# EasyEDA Pro project pcb easy eda pro stm32wb5mmg01 - Elektor.eprj, schematic Power command for stm32wb5
Create Date: 2024-01-22; Page Name: P1; Project Name: stm32wb5mmg01; Schematic Name: Schematic1; Update Date: 2024-01-22; Company: EasyEDA.com; Drawn: EasyEDA; Page Size: A4; Part Number: JLCPCB-002; Reviewed: EasyEDA; Version: V0.1
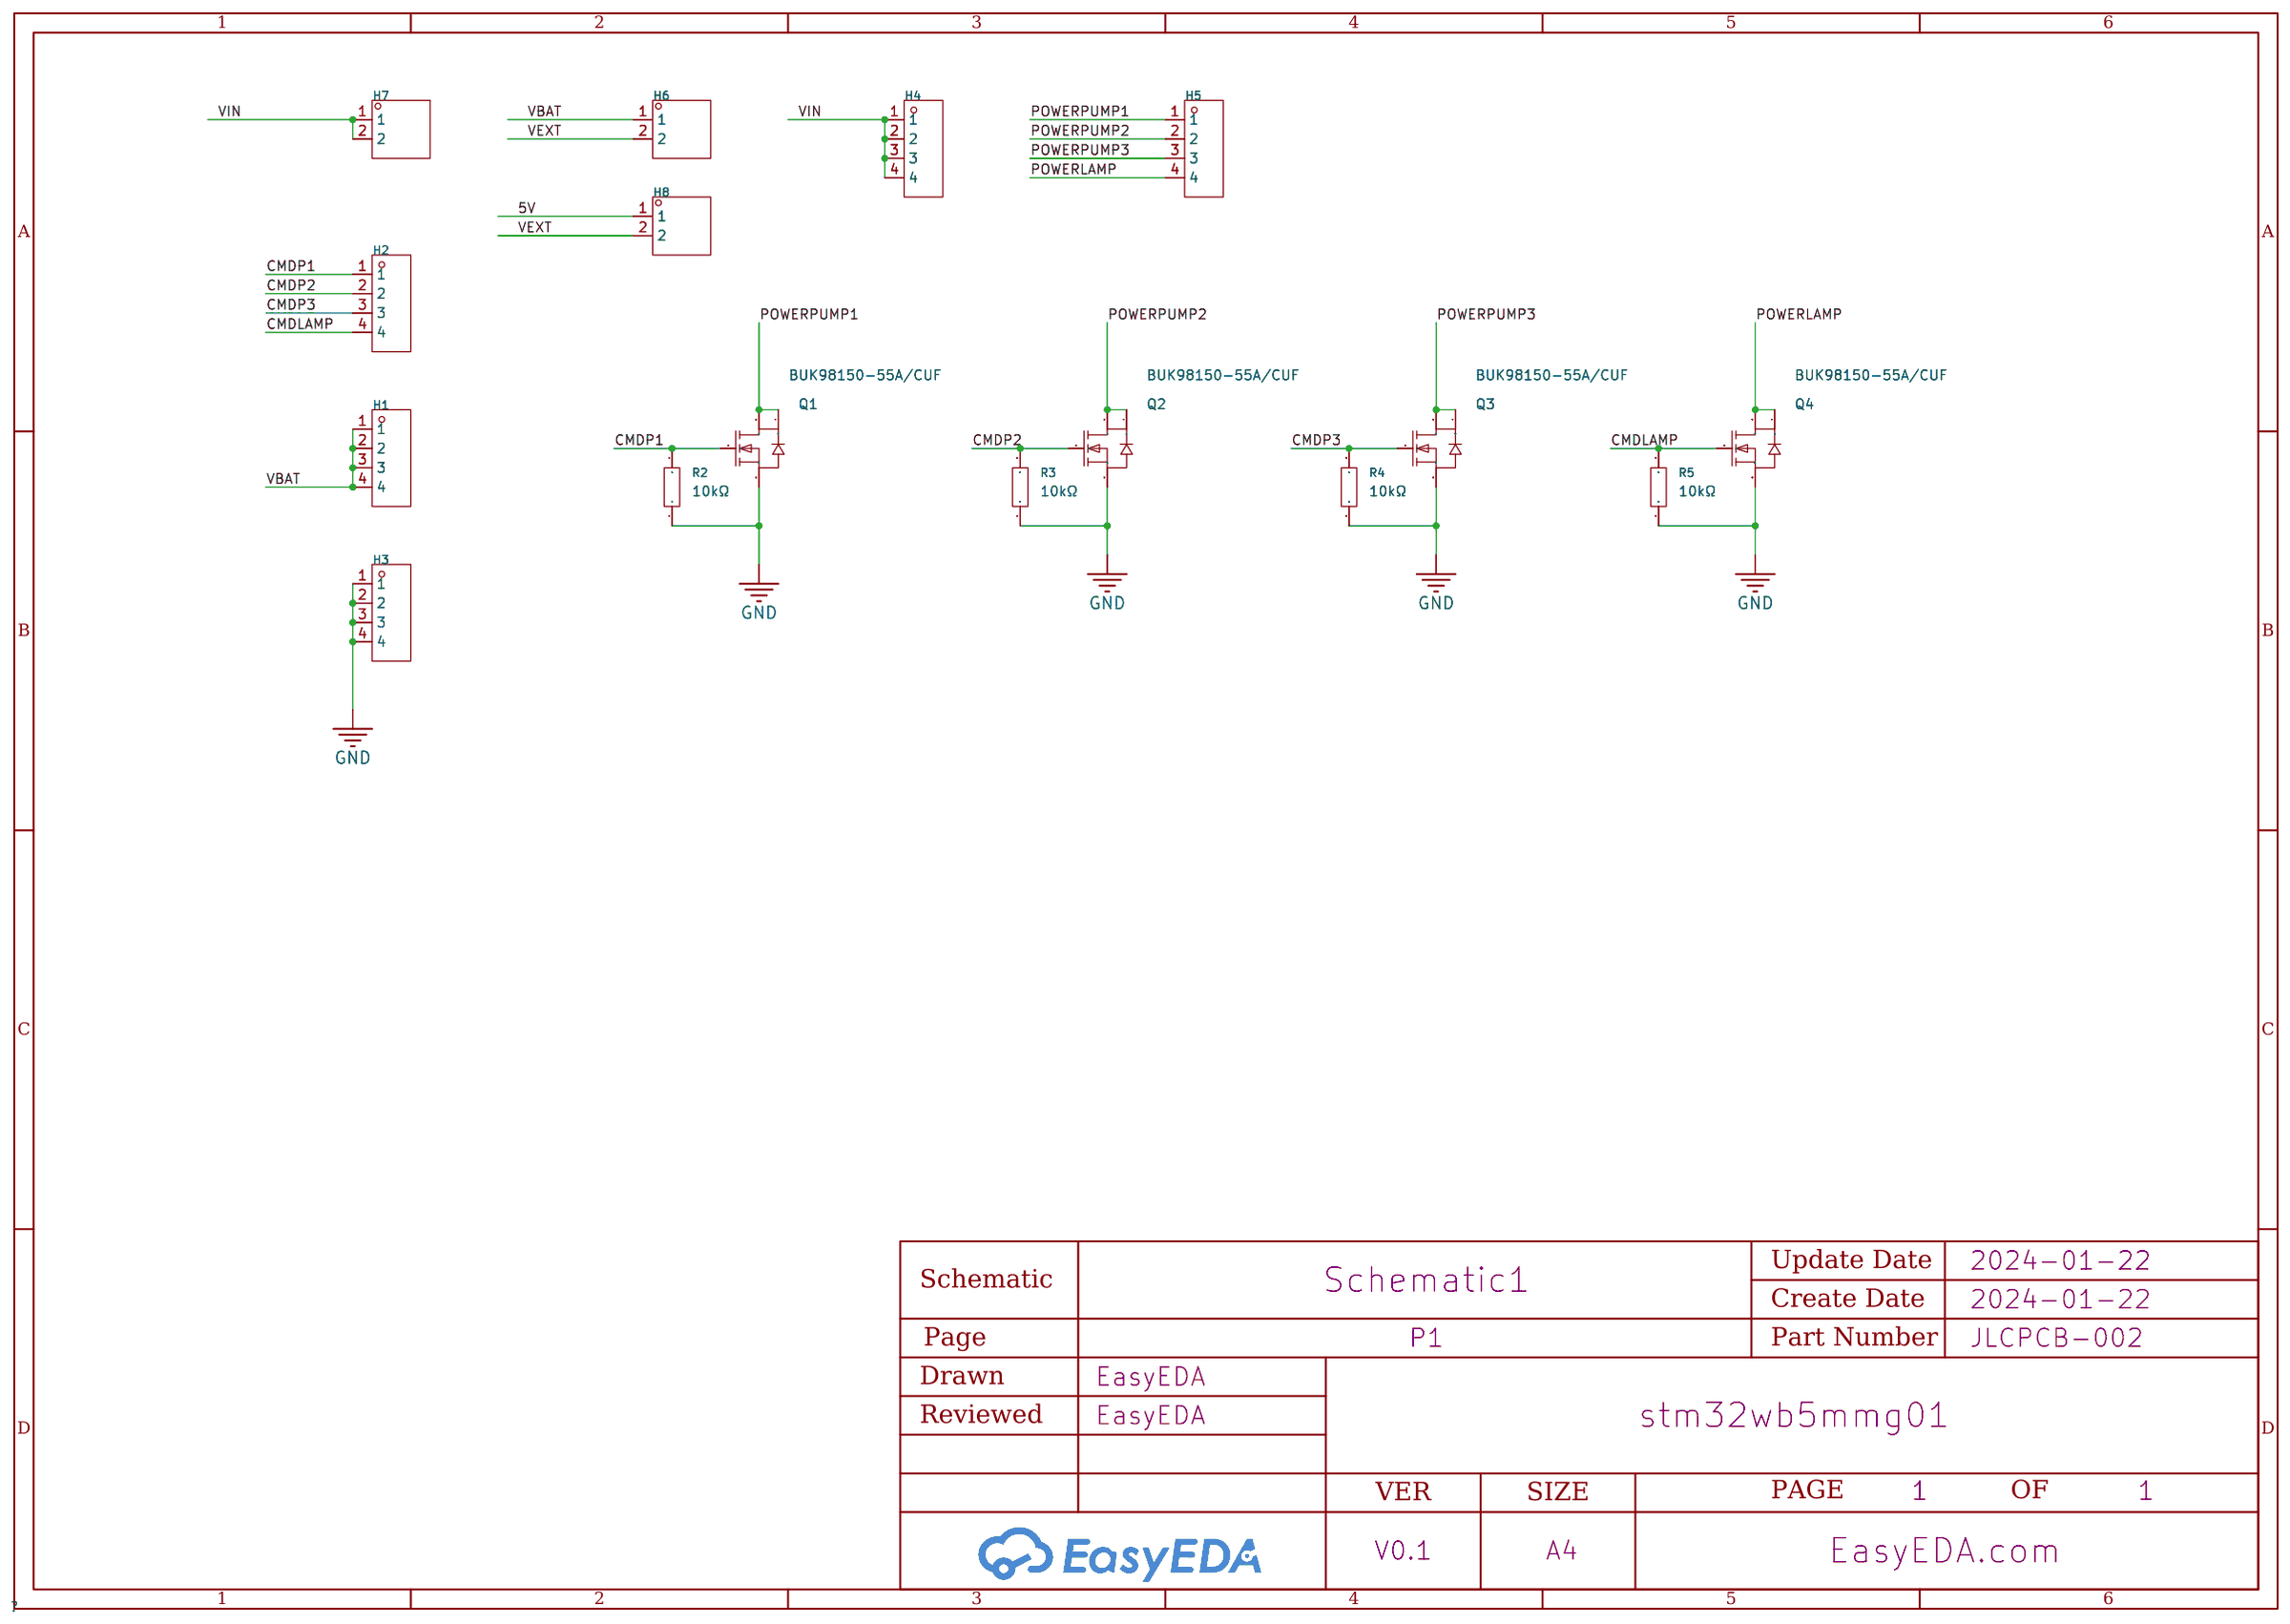
[diagram p2: schematic sheet]

## Parts
H1  -  [HDR-TH_4P-P2.54-V-M]
H2  -  [HDR-TH_4P-P2.54-V-M]
H3  -  [HDR-TH_4P-P2.54-V-M]
H4  -  [HDR-TH_4P-P2.54-V-M]
H5  -  [HDR-TH_4P-P2.54-V-M]
H6  -  [HDR-TH_2P-P2.54-V-M-1]
H7  -  [HDR-TH_2P-P2.54-V-M-1]
H8  -  [HDR-TH_2P-P2.54-V-M-1]
Q1  BUK98150-55A/CUF  [SOT-223-3_L6.5-W3.4-P2.30-LS7.0-BR]
Q2  BUK98150-55A/CUF  [SOT-223-3_L6.5-W3.4-P2.30-LS7.0-BR]
Q3  BUK98150-55A/CUF  [SOT-223-3_L6.5-W3.4-P2.30-LS7.0-BR]
Q4  BUK98150-55A/CUF  [SOT-223-3_L6.5-W3.4-P2.30-LS7.0-BR]
R2  10kΩ  [R1206]
R3  10kΩ  [R1206]
R4  10kΩ  [R1206]
R5  10kΩ  [R1206]

## Library data of the parts
H1-H5 = HDR-M_2.54_1x4P: Supplier Footprint: Through
H6-H8 = HDR-M_2.54_1x2P: Supplier Footprint: Through
Q1-Q4 = BUK98150-55A/CUF: Type: Drain Source Voltage (Vdss): Continuous Drain Current (Id): Power Dissipation (Pd): Drain Source On Resistance (RDS(on)@Vgs,Id):137mΩ@10V,5A Gate Threshold Voltage (Vgs(th)@Id):2V@1mA Total Gate Charge (Qg@Vgs):5.3nC@5V Input Capacitance (Ciss@Vds):; LCSC Part Name: N沟道 55V 5.5A; Supplier Part: C458219; Manufacturer: Nexperia(安世); Supplier Footprint: SOT-223; JLCPCB Part Class: Extended Part; Datasheet: https://atta.szlcsc.com/upload/public/pdf/source/20191121/C458219_4BA6FEB91EB7C469429BA4E15CAC82FB.pdf; Supplier: LCSC; Drain Source On Resistance (RDS(on)@Vgs,Id): 137mΩ@10V,5A; Gate Threshold Voltage (Vgs(th)@Id): 2V@1mA; Total Gate Charge (Qg@Vgs): 5.3nC@5V; Input Capacitance (Ciss@Vds): 320pF@25V; Operating Temperature: -55℃~+150℃@(Tj)
R2-R5 = 1206W4F1002T5E: Resistance:10000Ω Tolerance:±1% Tolerance:±1% Power(Watts): Overload Voltage (Max): Temperature Coefficient:±100ppm/℃ Temperature Coefficient:±100ppm/℃ Type:Thick Film Resistors Operating Temperature Range:-55℃~+155℃ Operating Temperature Range:-55℃~+155℃; LCSC Part Name: 10kΩ ±1% 250mW 厚膜电阻; Supplier Part: C17902; Manufacturer: UNI-ROYAL(厚声); Supplier Footprint: 1206; JLCPCB Part Class: Basic Part; Datasheet: https://atta.szlcsc.com/upload/public/pdf/source/20200306/C422600_1E6D84923E4A46A82E41ADD87F860B5C.pdf; Supplier: LCSC; Tolerance: ±1%; Temperature Coefficient: ±100ppm/℃; Type: Thick Film Resistors; Operating Temperature Range: -55℃~+155℃

## Nets
5V: H8.1
GND: H3.1 H3.2 H3.3 H3.4 Q1.3(S) Q2.3(S) Q3.3(S) Q4.3(S) R2.1 R3.1 R4.1 R5.1
VBAT: H1.1 H1.2 H1.3 H1.4 H6.1
VIN: H4.1 H4.2 H4.3 H4.4 H7.1 H7.2
CMDLAMP: H2.4 Q4.1(G) R5.2
CMDP1: H2.1 Q1.1(G) R2.2
CMDP2: H2.2 Q2.1(G) R3.2
CMDP3: H2.3 Q3.1(G) R4.2
POWERLAMP: H5.4 Q4.2(D) Q4.4(D)
POWERPUMP1: H5.1 Q1.2(D) Q1.4(D)
POWERPUMP2: H5.2 Q2.2(D) Q2.4(D)
POWERPUMP3: H5.3 Q3.2(D) Q3.4(D)
VEXT: H6.2 H8.2
